# Altium schematic sheet Sheet2.SchDoc
size A2
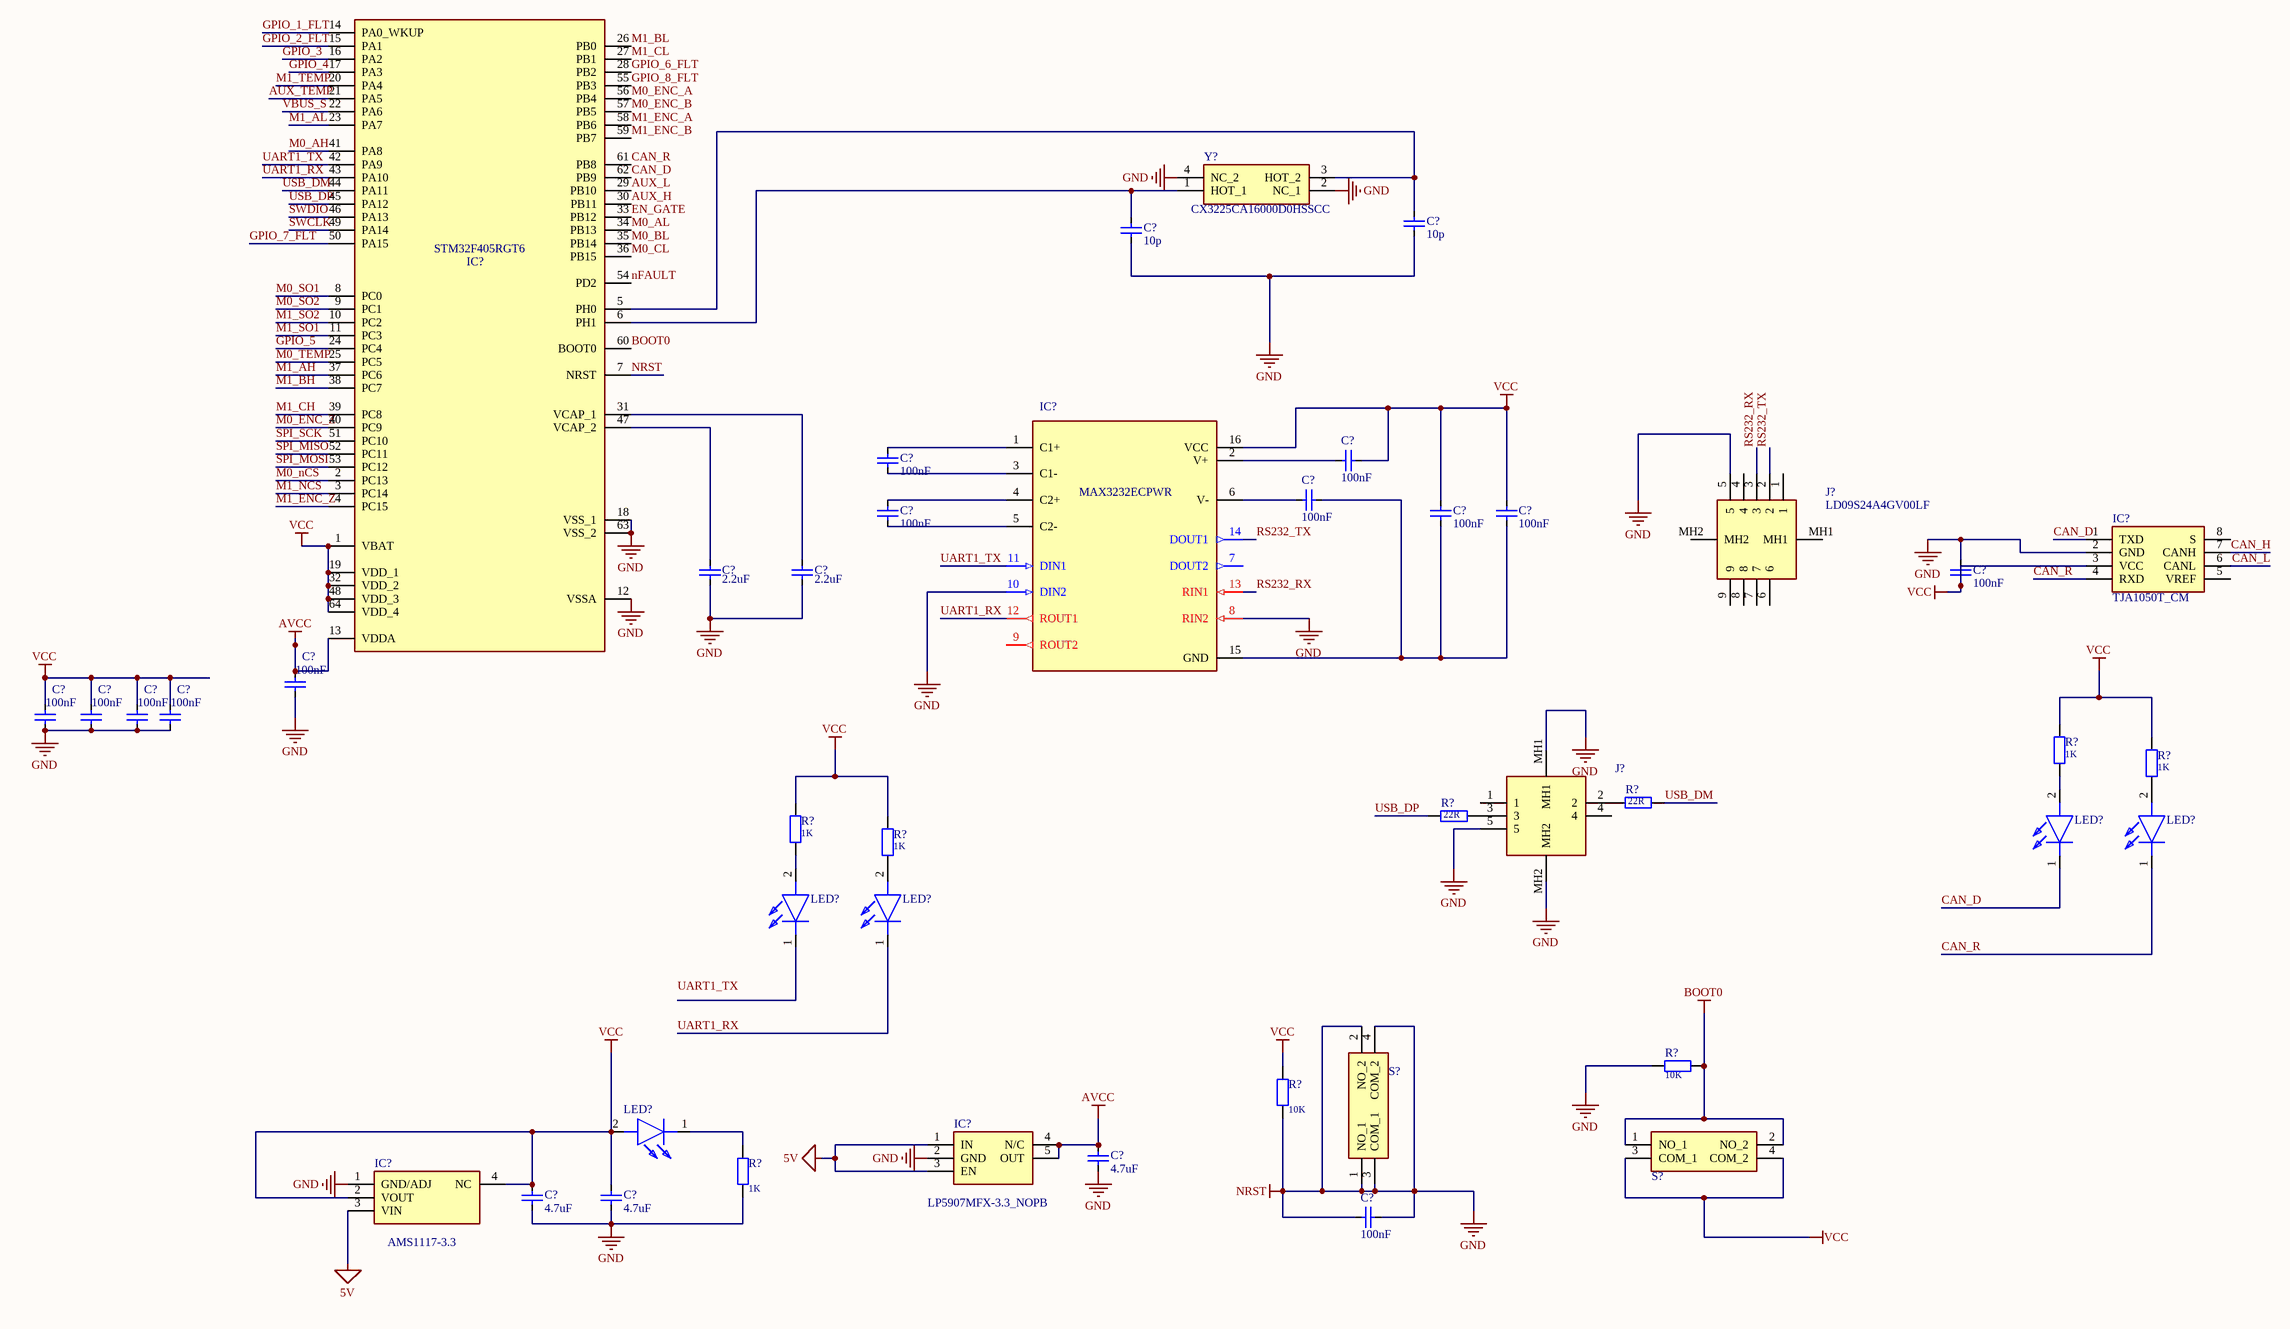
[diagram p0: Sheet2.SchDoc]

## Parts
(Parts that share a designator on the sheet are numbered #1, #2 ... from top to bottom, then left to right.)
C?#1  value 10p  [CAPC1005X06N]  (hidden comment: C)
C?#2  value 10p  [CAPC1005X06N]  (hidden comment: C)
C?#3  value 100nF  [CAPC1608X09N]  (hidden comment: C)
C?#4  value 100nF  [CAPC1608X09N]  (hidden comment: C)
C?#5  value 100nF  [CAPC1608X09N]  (hidden comment: C)
C?#6  value 100nF  [CAPC1608X09N]  (hidden comment: C)
C?#7  value 100nF  [CAPC1608X09N]  (hidden comment: C)
C?#8  value 100nF  [CAPC1608X09N]  (hidden comment: C)
C?#9  value 2.2uF  [CAPC1608X09N]  (hidden comment: C)
C?#10  value 2.2uF  [CAPC1608X09N]  (hidden comment: C)
C?#11  value 100nF  [CAPC1608X09N]  (hidden comment: C)
C?#12  value 100nF  [CAPC1005X06N]  (hidden comment: C)
C?#13  value 100nF  [CAPC1005X06N]  (hidden comment: C)
C?#14  value 100nF  [CAPC1005X06N]  (hidden comment: C)
C?#15  value 100nF  [CAPC1005X06N]  (hidden comment: C)
C?#16  value 100nF  [CAPC1005X06N]  (hidden comment: C)
C?#17  value 4.7uF  [CAPC1608X09N]  (hidden comment: C)
C?#18  value 4.7uF  [CAPC1608X09N]  (hidden comment: C)
C?#19  value 4.7uF  [CAPC1608X09N]  (hidden comment: C)
C?#20  value 100nF  [CAPC1608X09N]  (hidden comment: C)
IC?#1  STM32F405RGT6  [QFP50P1200X1200X160-64N]
IC?#2  MAX3232ECPWR  [SOP65P640X120-16N]
IC?#3  TJA1050T_CM  [SOIC127P600X175-8N]
IC?#4  LP5907MFX-3.3_NOPB  [SOT95P280X145-5N]
IC?#5  AMS1117-3.3  [SOT229P700X180-4N]
J?#1  LD09S24A4GV00LF  [LD09S24A4GV00LF]
J?#2  10119313-301TLF  [10119313301TLF]  (value not drawn)
LED?#1  LTST-C190KGKT  [LEDC1608X80N]  (value not drawn)
LED?#2  LTST-C190KGKT  [LEDC1608X80N]  (value not drawn)
LED?#3  LTST-C190KGKT  [LEDC1608X80N]  (value not drawn)
LED?#4  LTST-C190KGKT  [LEDC1608X80N]  (value not drawn)
LED?#5  LTST-C190KGKT  [LEDC1608X80N]  (value not drawn)
R?#1  value 1K  [RESC1608X06N]  (hidden comment: R)
R?#2  value 1K  [RESC1608X06N]  (hidden comment: R)
R?#3  value 22R  [RESC1608X06N]  (hidden comment: R)
R?#4  value 22R  [RESC1608X06N]  (hidden comment: R)
R?#5  value 1K  [RESC1608X06N]  (hidden comment: R)
R?#6  value 1K  [RESC1608X06N]  (hidden comment: R)
R?#7  value 10K  [RESC1005X04N]  (hidden comment: R)
R?#8  value 10K  [RESC1005X04N]  (hidden comment: R)
R?#9  value 1K  [RESC1005X04N]  (hidden comment: R)
S?#1  TS18-5-25-SL-260-SMT-TR  [TS18525SL260SMTTR]  (value not drawn)
S?#2  TS18-5-25-SL-260-SMT-TR  [TS18525SL260SMTTR]  (value not drawn)
Y?  CX3225CA16000D0HSSCC  [CX3225CA16000D0HSSCC]

## Nets
5V: IC?#4.1(IN) IC?#4.3(EN) IC?#5.3(VIN)
AVCC: C?#12.2 C?#17.1 IC?#1.13(VDDA) IC?#4.4(N/C) IC?#4.5(OUT)
BOOT0: IC?#1.60(BOOT0) R?#7.2 S?#1.1(NO_1) S?#1.2(NO_2)
NRST: C?#1.2 C?#2.2 C?#9.1 C?#10.1 C?#11.2 C?#12.1 C?#13.1 C?#14.1 C?#15.1 C?#16.1 C?#17.2 C?#18.2 C?#19.2 C?#20.1 C?#20.2 IC?#1.7(NRST) IC?#1.12(VSSA) IC?#1.18(VSS_1) IC?#1.63(VSS_2) IC?#2.8(RIN2) IC?#2.10(DIN2) IC?#3.2(GND) IC?#4.2(GND) IC?#5.1(GND/ADJ) J?#1.5 J?#2.5 J?#2.MH1 J?#2.MH2 R?#7.1 R?#8.2 R?#9.1 S?#2.1(NO_1) S?#2.2(NO_2) S?#2.3(COM_1) S?#2.4(COM_2) Y?.2(NC_1) Y?.4(NC_2)  [also labelled GND]
VCC: C?#3.2 C?#7.2 C?#8.2 C?#11.1 C?#13.2 C?#14.2 C?#15.2 C?#16.2 C?#18.1 C?#19.1 IC?#1.1(VBAT) IC?#1.19(VDD_1) IC?#1.32(VDD_2) IC?#1.48(VDD_3) IC?#1.64(VDD_4) IC?#2.16(VCC) IC?#3.3(VCC) IC?#5.2(VOUT) IC?#5.4(NC) LED?#5.2(A) R?#1.1 R?#2.1 R?#5.1 R?#6.1 R?#8.1 S?#1.3(COM_1) S?#1.4(COM_2)
AUX_H: IC?#1.30(PB11)
AUX_L: IC?#1.29(PB10)
AUX_TEMP: IC?#1.21(PA5)
CAN_D: IC?#1.62(PB9) IC?#3.1(TXD) LED?#1.1(K)
CAN_H: IC?#3.7(CANH)
CAN_L: IC?#3.6(CANL)
CAN_R: IC?#1.61(PB8) IC?#3.4(RXD) LED?#2.1(K)
EN_GATE: IC?#1.33(PB12)
GPIO_1_FLT: IC?#1.14(PA0_WKUP)
GPIO_2_FLT: IC?#1.15(PA1)
GPIO_3: IC?#1.16(PA2)
GPIO_4: IC?#1.17(PA3)
GPIO_5: IC?#1.24(PC4)
GPIO_6_FLT: IC?#1.28(PB2)
GPIO_7_FLT: IC?#1.50(PA15)
GPIO_8_FLT: IC?#1.55(PB3)
M0_AH: IC?#1.41(PA8)
M0_AL: IC?#1.34(PB13)
M0_BL: IC?#1.35(PB14)
M0_CL: IC?#1.36(PB15)
M0_ENC_A: IC?#1.56(PB4)
M0_ENC_B: IC?#1.57(PB5)
M0_ENC_Z: IC?#1.40(PC9)
M0_nCS: IC?#1.2(PC13)
M0_SO1: IC?#1.8(PC0)
M0_SO2: IC?#1.9(PC1)
M0_TEMP: IC?#1.25(PC5)
M1_AH: IC?#1.37(PC6)
M1_AL: IC?#1.23(PA7)
M1_BH: IC?#1.38(PC7)
M1_BL: IC?#1.26(PB0)
M1_CH: IC?#1.39(PC8)
M1_CL: IC?#1.27(PB1)
M1_ENC_A: IC?#1.58(PB6)
M1_ENC_B: IC?#1.59(PB7)
M1_ENC_Z: IC?#1.4(PC15)
M1_NCS: IC?#1.3(PC14)
M1_SO1: IC?#1.11(PC3)
M1_SO2: IC?#1.10(PC2)
M1_TEMP: IC?#1.20(PA4)
nFAULT: IC?#1.54(PD2)
RS232_RX: IC?#2.13(RIN1) J?#1.3
RS232_TX: IC?#2.14(DOUT1) J?#1.2
SPI_MISO: IC?#1.52(PC11)
SPI_MOSI: IC?#1.53(PC12)
SPI_SCK: IC?#1.51(PC10)
SWCLK: IC?#1.49(PA14)
SWDIO: IC?#1.46(PA13)
UART1_RX: IC?#1.43(PA10) IC?#2.12(ROUT1) LED?#4.1(K)
UART1_TX: IC?#1.42(PA9) IC?#2.11(DIN1)
USB_DM: IC?#1.44(PA11) R?#3.2
USB_DP: IC?#1.45(PA12) R?#4.1
VBUS_S: IC?#1.22(PA6)
NetC?#1_1: C?#1.1 IC?#1.5(PH0) Y?.3(HOT_2)
NetC?#2_1: C?#2.1 IC?#1.6(PH1) Y?.1(HOT_1)
NetC?#3_1: C?#3.1 IC?#2.2(V+)
NetC?#4_1: C?#4.1 IC?#2.3(C1-)
NetC?#4_2: C?#4.2 IC?#2.1(C1+)
NetC?#5_1: C?#5.1 C?#7.1 C?#8.1 IC?#2.15(GND)
NetC?#5_2: C?#5.2 IC?#2.6(V-)
NetC?#6_1: C?#6.1 IC?#2.5(C2-)
NetC?#6_2: C?#6.2 IC?#2.4(C2+)
NetC?#9_2: C?#9.2 IC?#1.47(VCAP_2)
NetC?#10_2: C?#10.2 IC?#1.31(VCAP_1)
NetJ?#2_2: J?#2.2 R?#3.1
NetJ?#2_3: J?#2.3 R?#4.2
NetLED?#1_2: LED?#1.2(A) R?#1.2
NetLED?#2_2: LED?#2.2(A) R?#2.2
NetLED?#3_2: LED?#3.2(A) R?#5.2
NetLED?#4_2: LED?#4.2(A) R?#6.2
NetLED?#5_1: LED?#5.1(K) R?#9.2

Not connected (* = marked no-connect by the designer): IC?#2 7(DOUT2) 9(ROUT2); IC?#3 5(VREF) 8(S); J?#1 1 4 6 7 8 9 MH1 MH2; J?#2 1 4; LED?#3 1(K)

## Notes on the sheet
- Labels drawn without touching a wire or pin: UART1_TX
- Title
- Size:
- Date:
- File:
- A2
- Number:
- Time:
- Revision:
- Sheet
- of

## Library data of the parts
C?#1 C?#2 = C: MPN: 0603CG100J250NT; Link: https://www.lcsc.com/product-detail/Multilayer-Ceramic-Capacitors-MLCC-SMD-SMT_FH-Guangdong-Fenghua-Advanced-Tech-0603CG100J250NT_C2939806.html
C?#3-C?#8 C?#11-C?#16 C?#20 = C: MPN: 06033C104KAT4A; Link: https://www.lcsc.com/product-detail/Multilayer-Ceramic-Capacitors-MLCC-SMD-SMT_Kyocera-AVX-06033C104KAT4A_C2167104.html
C?#9 C?#10 = C: MPN: 0603B225K250NT; Link: https://www.lcsc.com/product-detail/Multilayer-Ceramic-Capacitors-MLCC-SMD-SMT_FH-Guangdong-Fenghua-Advanced-Tech-0603B225K250NT_C99228.html
C?#17-C?#19 = C: MPN: GRM188C81E475KE11D; Link: https://www.lcsc.com/product-detail/Multilayer-Ceramic-Capacitors-MLCC-SMD-SMT_Murata-Electronics-GRM188C81E475KE11D_C417145.html
IC?#1 = STM32F405RGT6: Integrated Circuit; Manufacturer_Name: STMicroelectronics; Datasheet Link: http://www.st.com/web/en/resource/technical/document/datasheet/DM00037051.pdf; Height: 1.6mm; Manufacturer_Part_Number: STM32F405RGT6; Mouser Part Number: 511-STM32F405RGT6; Mouser Price/Stock: https://www.mouser.co.uk/ProductDetail/STMicroelectronics/STM32F405RGT6?qs=Z8%252BeY1k3TIKgj7QWsYGpQw%3D%3D; Arrow Part Number: STM32F405RGT6; Arrow Price/Stock: https://www.arrow.com/en/products/stm32f405rgt6/stmicroelectronics?utm_currency=USD&region=nac
IC?#2 = MAX3232ECPWR: Integrated Circuit; Manufacturer_Name: Texas Instruments; Datasheet Link: http://www.ti.com/general/docs/lit/getliterature.tsp?genericPartNumber=MAX3232E&fileType=pdf&HQS=ti-null-null-sf-df-pf-sep-wwe&DCM=yes; Height: 1.2mm; Manufacturer_Part_Number: MAX3232ECPWR; Mouser Part Number: 595-MAX3232ECPWR; Mouser Price/Stock: https://www.mouser.co.uk/ProductDetail/Texas-Instruments/MAX3232ECPWR?qs=paYhMW8qfis8NsHohmO7ng%3D%3D; Arrow Part Number: MAX3232ECPWR; Arrow Price/Stock: https://www.arrow.com/en/products/max3232ecpwr/texas-instruments?region=nac
IC?#3 = TJA1050T_CM: Integrated Circuit; Manufacturer_Name: NXP; Manufacturer_Part_Number: XL1050; Datasheet Link: https://www.tme.eu/Document/977d0fd8449c416da25cef30c4f64641/TJA1050.pdf; Height: 1.75mm; Mouser Part Number: N/A; Mouser Price/Stock: https://www.mouser.co.uk/ProductDetail/NXP-Semiconductors/TJA1050T-CM?qs=fAHHVMwC%252BbibiWs27gP5ng%3D%3D; link: https://www.lcsc.com/product-detail/CAN-Transceivers_XINLUDA-XL1050_C609746.html
IC?#4 = LP5907MFX-3.3_NOPB: Integrated Circuit; Manufacturer_Name: Texas Instruments; Manufacturer_Part_Number: LP5907MFX-3.3/NOPB; Datasheet Link: https://datasheet.datasheetarchive.com/originals/distributors/Datasheets-SFU2/DSASFU100037200.pdf; Height: 1.45mm; Mouser Part Number: 595-LP5907MFX-3.3NPB; Mouser Price/Stock: https://www.mouser.co.uk/ProductDetail/Texas-Instruments/LP5907MFX-3.3-NOPB?qs=biyDIajrTn6NhrJCoL%2FdSQ%3D%3D; Arrow Part Number: LP5907MFX-3.3/NOPB; Arrow Price/Stock: https://www.arrow.com/en/products/lp5907mfx-3.3nopb/texas-instruments?utm_currency=USD&region=nac
IC?#5 = AMS1117-3.3: Integrated Circuit; Manufacturer_Name: Advanced; Datasheet Link: https://datasheet.datasheetarchive.com/originals/distributors/Datasheets-28/DSA-550594.pdf; Height: 1.8mm; Manufacturer_Part_Number: AMS1117-3.3
J?#1 = LD09S24A4GV00LF: Connector; Manufacturer_Name: Amphenol Communications Solutions; Datasheet Link: https://cdn.amphenol-cs.com/media/wysiwyg/files/drawing/10130912.pdf; Height: 12.39mm; Manufacturer_Part_Number: LD09S24A4GV00LF; Arrow Part Number: LD09S24A4GV00LF; Arrow Price/Stock: https://www.arrow.com/en/products/ld09s24a4gv00lf/amphenol-fci?utm_currency=USD&region=nac
J?#2 = 10119313-301TLF: Connector; Manufacturer_Name: Amphenol; Manufacturer_Part_Number: HX MINI5P T; Datasheet Link: https://cdn.amphenol-cs.com/media/wysiwyg/files/drawing/10119313.pdf; Height: 9.7mm; Mouser Part Number: 649-10119313-301TLF; Mouser Price/Stock: https://www.mouser.co.uk/ProductDetail/Amphenol-FCI/10119313-301TLF?qs=QcFhgjUTvvrAeUuachPUXg%3D%3D; link: https://www.lcsc.com/product-detail/USB-Connectors_hanxia-HX-MINI5P-T_C19189146.html
LED?#1 LED?#3 = LTST-C190KGKT: LED; Manufacturer_Name: Lite-On; Manufacturer_Part_Number: XL-1608UBC-04; Datasheet Link: http://uk.rs-online.com/web/p/visible-leds/6920988/; Height: 0.8mm; Mouser Part Number: 859-LTST-C190KGKT; Mouser Price/Stock: https://www.mouser.co.uk/ProductDetail/Lite-On/LTST-C190KGKT?qs=205qCy6M2Q%252BAdcgwUZktqw%3D%3D; Arrow Part Number: LTST-C190KGKT; Arrow Price/Stock: https://www.arrow.com/en/products/ltst-c190kgkt/lite-on-technology?region=europe
LED?#2 LED?#4 = LTST-C190KGKT: LED; Manufacturer_Name: Lite-On; Manufacturer_Part_Number: XL-1608PGC-06; Datasheet Link: http://uk.rs-online.com/web/p/visible-leds/6920988/; Height: 0.8mm; Mouser Part Number: 859-LTST-C190KGKT; Mouser Price/Stock: https://www.mouser.co.uk/ProductDetail/Lite-On/LTST-C190KGKT?qs=205qCy6M2Q%252BAdcgwUZktqw%3D%3D; Arrow Part Number: LTST-C190KGKT; Arrow Price/Stock: https://www.arrow.com/en/products/ltst-c190kgkt/lite-on-technology?region=europe
LED?#5 = LTST-C190KGKT: LED; Manufacturer_Name: Lite-On; Datasheet Link: http://uk.rs-online.com/web/p/visible-leds/6920988/; Height: 0.8mm; Manufacturer_Part_Number: LTST-C190KGKT; Mouser Part Number: 859-LTST-C190KGKT; Mouser Price/Stock: https://www.mouser.co.uk/ProductDetail/Lite-On/LTST-C190KGKT?qs=205qCy6M2Q%252BAdcgwUZktqw%3D%3D; Arrow Part Number: LTST-C190KGKT; Arrow Price/Stock: https://www.arrow.com/en/products/ltst-c190kgkt/lite-on-technology?region=europe
R?#3 R?#4 = R: MPN: ARG03FTC0220; Link: https://www.lcsc.com/product-detail/Chip-Resistor-Surface-Mount_Viking-Tech-ARG03FTC0220_C217888.html
R?#7 R?#8 = R: MPN: RC0603FR-0710KL; Link: https://www.lcsc.com/product-detail/Chip-Resistor-Surface-Mount_YAGEO-RC0603FR-0710KL_C98220.html
S?#1 S?#2 = TS18-5-25-SL-260-SMT-TR: Switch; Manufacturer_Name: Same Sky; Datasheet Link: https://www.cuidevices.com/product/resource/ts18.pdf; Height: 2.7mm; Manufacturer_Part_Number: TS18-5-25-SL-260-SMT-TR; Mouser Part Number: 179-TS18525SL260SMTT; Mouser Price/Stock: https://www.mouser.co.uk/ProductDetail/Same-Sky/TS18-5-25-SL-260-SMT-TR?qs=tlsG%2FOw5FFh0yS4gYnfcwg%3D%3D
Y? = CX3225CA16000D0HSSCC: Crystal or Oscillator; Manufacturer_Name: Kyocera AVX; MPN: TAXM8M4RDBCCT2T; Datasheet Link: https://media.digikey.com/pdf/Data%20Sheets/AVX%20PDFs/CX3225CA_%20Series_Spec.pdf; Height: 0.9mm; Manufacturer_Part_Number: CX3225CA16000D0HSSCC; Mouser Part Number: N/A; Mouser Price/Stock: https://www.mouser.co.uk/ProductDetail/Kyocera-Electronic-Components/CX3225CA16000D0HSSCC?qs=A6eO%252BMLsxmRcoOtVnFyCOA%3D%3D; Arrow Part Number: CX3225CA16000D0HSSCC; Arrow Price/Stock: https://www.arrow.com/en/products/cx3225ca16000d0hsscc/kyocera; LINK: https://www.lcsc.com/product-detail/Crystals_Yajingxin-TAXM8M4RDBCCT2T_C400090.html
R?#1 R?#2 R?#5 R?#6 R?#9 = R
  R?#9: MPN: *; Link: *